# EAGLE design untitled (EAGLE 9.5.2)
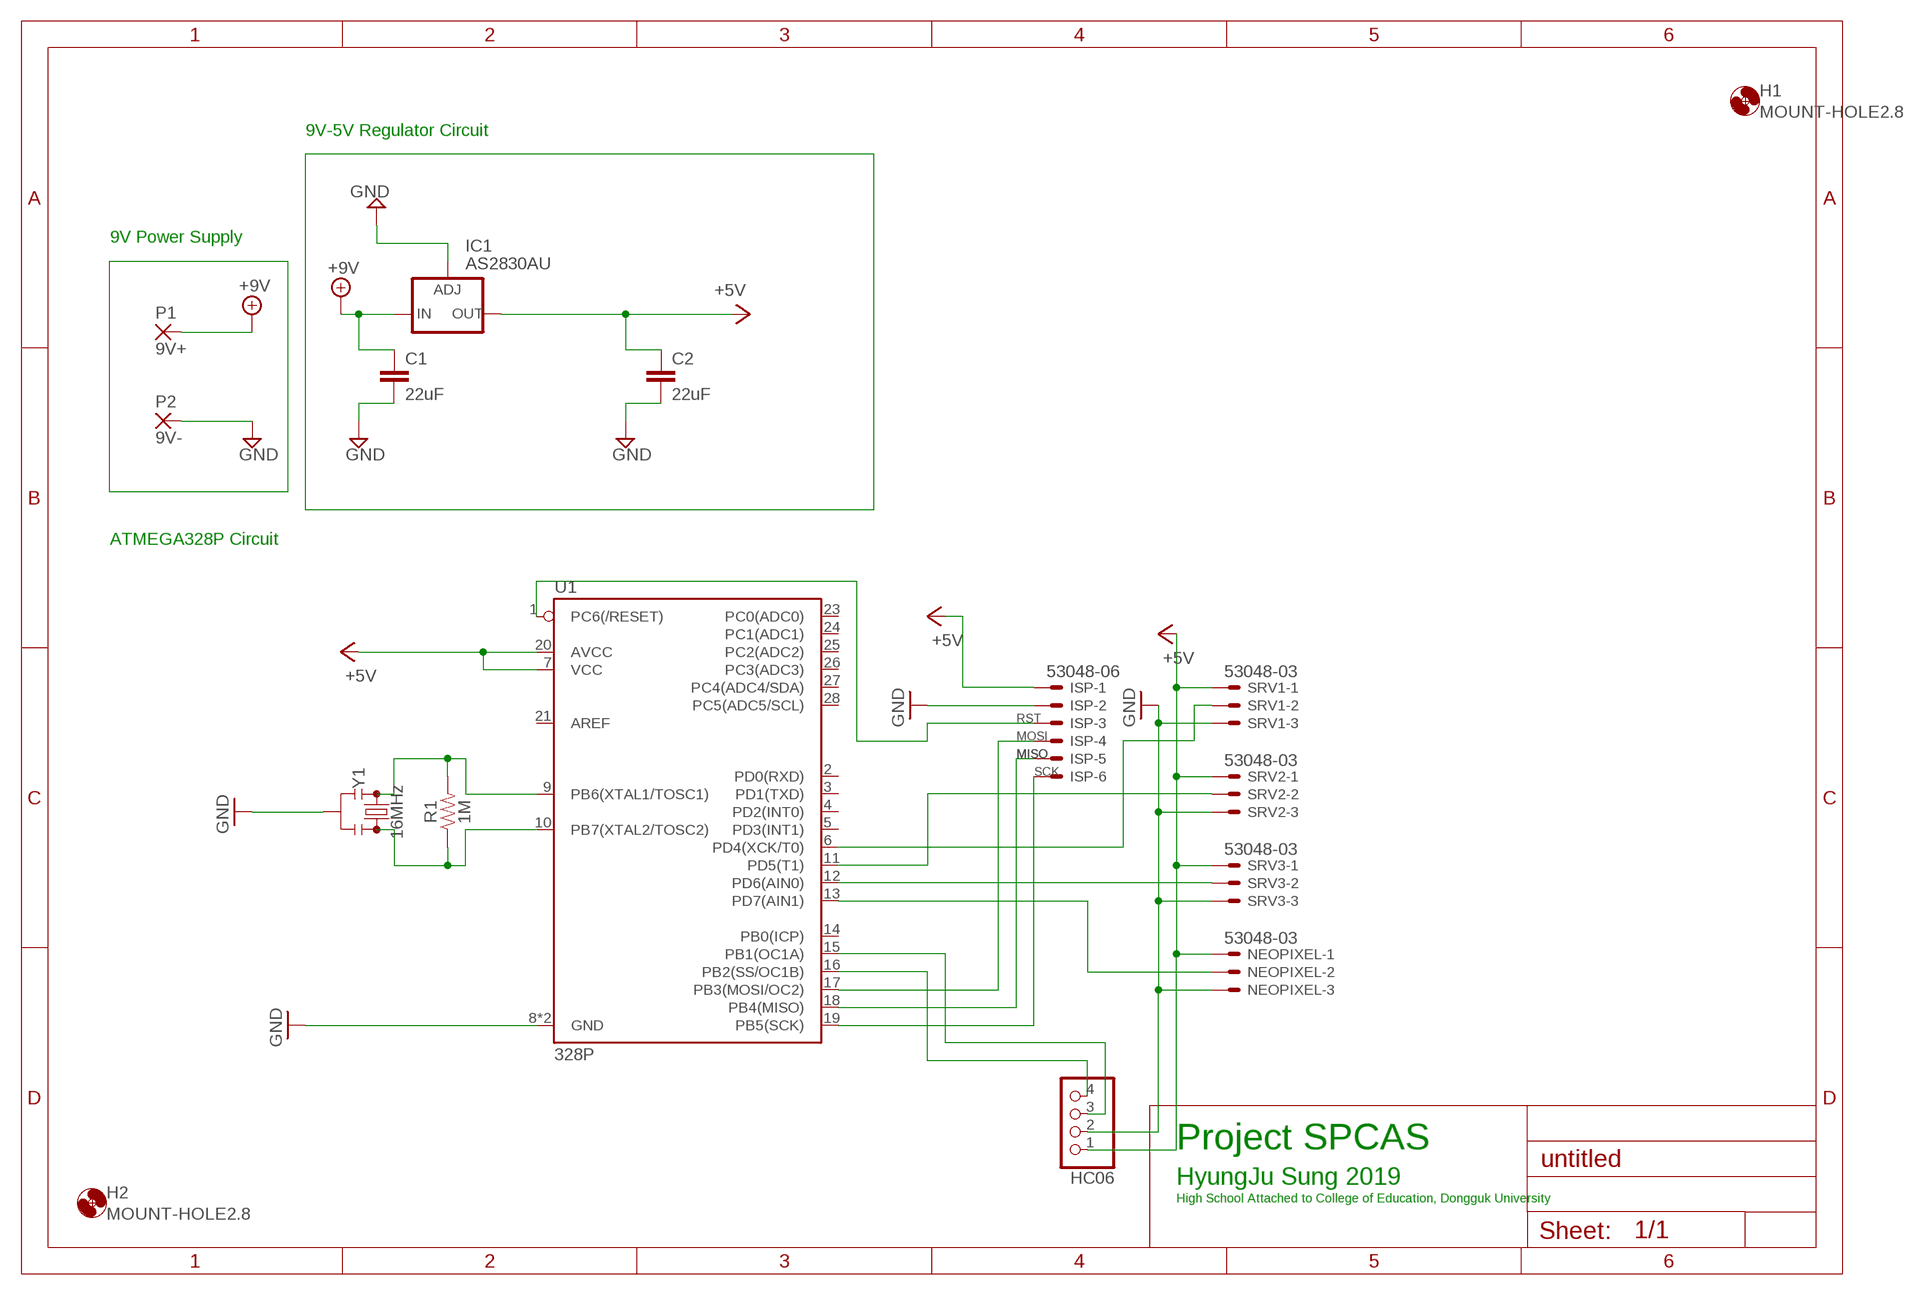
[diagram p0: schematic, sheet 1]

## Parts
C1  22uF  C2.5/2  [C2.5-2]
C2  22uF  C2.5/2  [C2.5-2]
H1  MOUNT-HOLE2.8  [2,8]
H2  MOUNT-HOLE2.8  [2,8]
HC06  PINHD-1X4/90  [1X04/90]
IC1  AS2830AU  LM337TL  [337TL]
ISP  53048-06  [53048-06]
NEOPIXEL  53048-03  [53048-03]
P1  9V+  SMD5  [SMD2,54-5,08]
P2  9V-  SMD5  [SMD2,54-5,08]
R1  1M  1MOHM-HORIZ-1/4W-5%  [AXIAL-0.3]
SRV1  53048-03  [53048-03]
SRV2  53048-03  [53048-03]
SRV3  53048-03  [53048-03]
U1  328P  ATMEGA328P_PDIP  [DIP28]
Y1  16MHz  RESONATOR-16MHZSMD_3.2X1.3  [RESONATOR-SMD-3.2X1.3]

## Nets
+5V: C2.1 HC06.1 IC1.3(OUT) ISP.1 NEOPIXEL.1 SRV1.1 SRV2.1 SRV3.1 U1.7(VCC) U1.20(AVCC)
+9V: C1.1 IC1.2(IN) P1.1(P)
GND: C1.2 C2.2 HC06.2 IC1.1(ADJ) ISP.2 NEOPIXEL.3 P2.1(P) SRV1.3 SRV2.3 SRV3.3 U1.8(GND) U1.22(GND) Y1.2
MISO: ISP.5 U1.18(PB4(MISO))
MOSI: ISP.4 U1.17(PB3(MOSI/OC2))
N$3: R1.P$2 U1.9(PB6(XTAL1/TOSC1)) Y1.1
N$4: R1.P$1 U1.10(PB7(XTAL2/TOSC2)) Y1.3
N$5: NEOPIXEL.2 U1.13(PD7(AIN1))
N$6: SRV3.2 U1.12(PD6(AIN0))
N$7: SRV2.2 U1.11(PD5(T1))
N$8: SRV1.2 U1.6(PD4(XCK/T0))
N$9: HC06.4 U1.16(PB2(SS/OC1B))
N$10: HC06.3 U1.15(PB1(OC1A))
RST: ISP.3 U1.1(PC6(/RESET))
SCK: ISP.6 U1.19(PB5(SCK))
Unconnected: U1.2(PD0(RXD)) U1.3(PD1(TXD)) U1.4(PD2(INT0)) U1.5(PD3(INT1)) U1.14(PB0(ICP)) U1.21(AREF) U1.23(PC0(ADC0)) U1.24(PC1(ADC1)) U1.25(PC2(ADC2)) U1.26(PC3(ADC3)) U1.27(PC4(ADC4/SDA)) U1.28(PC5(ADC5/SCL))

## Notes on the sheet
- 9V-5V Regulator Circuit
- 9V Power Supply
- ATMEGA328P Circuit
- Project SPCAS
- HyungJu Sung 2019
- High School Attached to College of Education, Dongguk University

## Library data of the parts
C1 C2 = capacitor-wima:C: CAPACITOR naming: grid - package width
H1 H2 = holes:MOUNT-HOLE: MOUNTING HOLE with drill center marker
HC06 = pinhead:PINHD-1X4: PIN HEADER
IC1 = v-reg:LM337TL: VOLTAGE REGULATOR
ISP = con-molex:53?-06: CONNECTOR wire to board 1.25 mm (.049 inch) pitch header; MF: WALDOM/MOLEX; MPN: 53048-0610; OC_FARNELL: 1012260; OC_NEWARK: 38C9911
NEOPIXEL SRV1-SRV3 = con-molex:53?-03: CONNECTOR wire to board 1.25 mm (.049 inch) pitch header; MF: WALDOM/MOLEX; MPN: 53048-0310; OC_FARNELL: 9732918; OC_NEWARK: 38C9908
P1 P2 = wirepad:SMD5: SMD PAD
R1 = SparkFun-Resistors:1MOHM: 1MΩ resistor A resistor is a passive two-terminal electrical component that implements electrical resistance as a circuit element. Resistors act to reduce current flow, and, at the same time, act to lower voltage levels within circuits. - Wikipedia; PROD_ID: RES-09329
U1 = SparkFun-IC-Microcontroller:ATMEGA328P_PDIP: Atmel 328P Through hole ATMEGA328P uC used in the Arduino 32kb flash, 1k EEPROM, 2k SRAM Datasheet <http://www.sparkfun.com/datasheets/Components/SMD/ATMega328.pdf> SparkFun Products Storefront component: AVR 28 Pin 20MHz 32K 6A/D - ATMega328P <https://www.sparkfun.com/products/9061> (COM-09061) SparkFun Simon Says - Through-Hole Soldering Kit <https://www.sparkfun.com/products/10547> (KIT-10547) SparkFun Learn to Solder - Simon Says <https://www.sparkfun.com/products/13708> (KIT-13708) SparkFun BigTime Watch Kit <https://www.sparkfun.com/products/11734> (KIT-11734) SparkFun ClockIt <https://www.sparkfun.com/products/10930> (KIT-10930) SparkFun Serial Enabled LCD Kit <https://www.sparkfun.com/products/10097> (LCD-10097) SparkFun Simon Tilts - Through Hole Soldering Kit <https://www.sparkfun.com/products/12634> (KIT-12634) SparkFun Frequency Counter Kit <https://www.sparkfun.com/products/10140> (KIT-10140) FabFM Radio Kit <https://www.sparkfun.com/products/11043> (KIT-11043) SparkFun Binary Blaster Kit <https://www.sparkfun.com/products/12037> (KIT-12037) SparkFun Metro-Gnome <https://www.sparkfun.com/products/9236> (KIT-09236) ATmega328 with Arduino Optiboot (Uno) <https://www.sparkfun.com/products/10524> (DEV-10524); PROD_ID: IC-09136
Y1 = SparkFun-Clocks:RESONATOR-16MHZ: 16MHz Resonator Digikey Example <http://www.digikey.com/product-detail/en/murata-electronics-north-america/CSTCE16M0V53-R0/490-1198-1-ND/584635> Frequency: 16MHz Frequency Stability: ±0.3% Frequency Tolerance: ±0.5% Capacitance: 15pF SparkFun Products SparkFun OpenLog <https://www.sparkfun.com/products/13712> SparkFun MicroView - OLED Arduino Module <https://www.sparkfun.com/products/12923>; PROD_ID: XTAL-08900

## Board
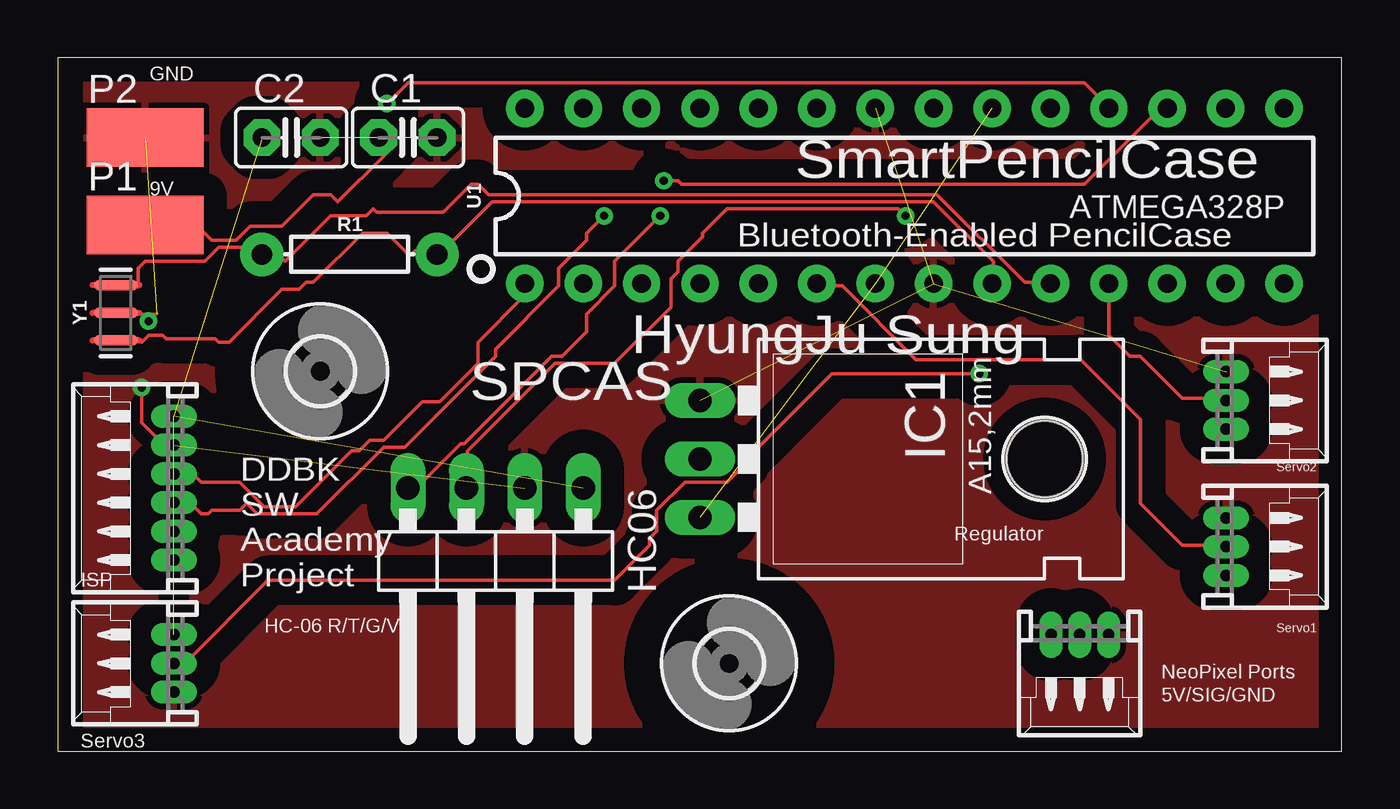
[diagram p1: board, top side]
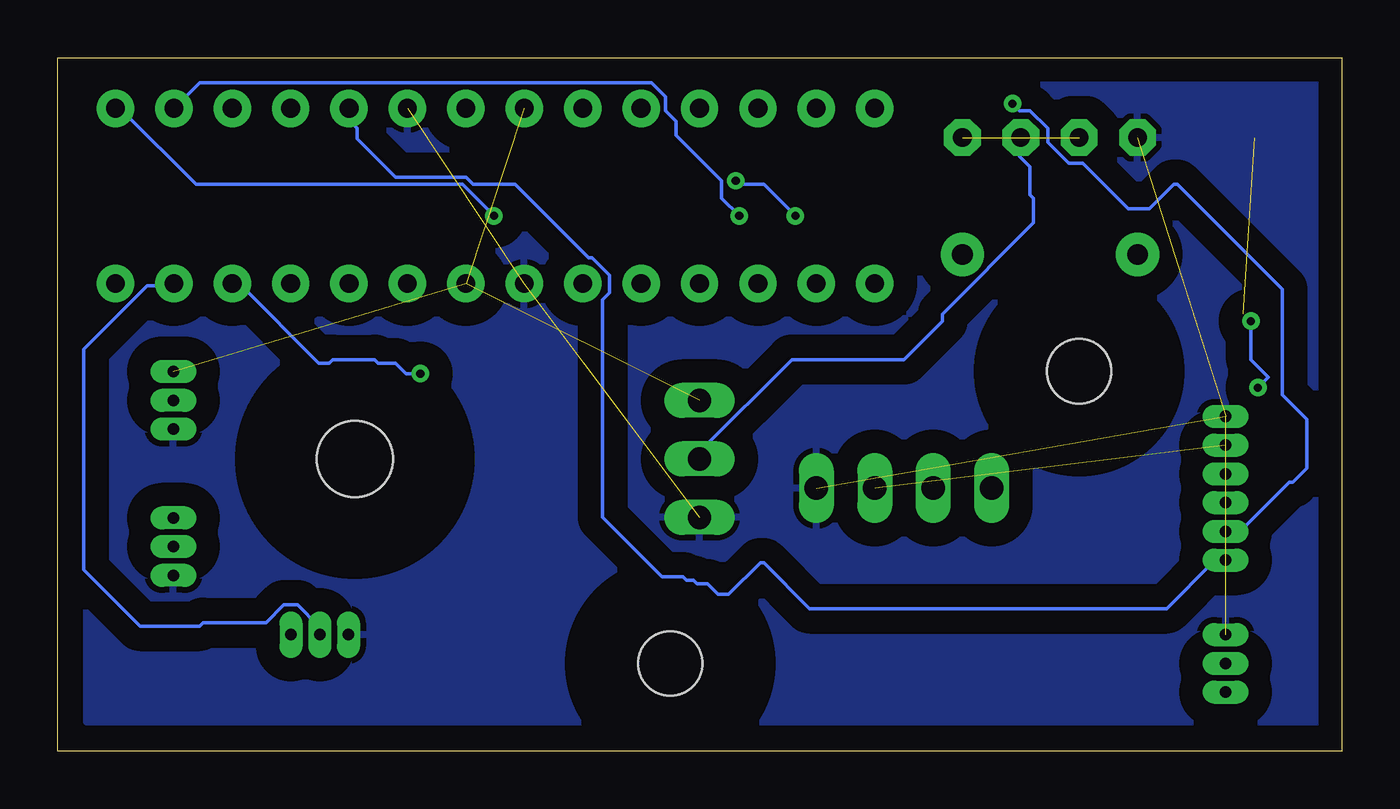
[diagram p2: board, bottom side, seen from below]

Size 55.86 x 30.15 mm. Coordinates in mm from the lower left corner, seen from the top.
Outline: 0,0 55.86,0 55.86,30.15 0,30.15 0,0
Copper layers (1*16): Top 0.035mm / dielectric 1.5mm / Bottom 0.035mm
Design rules "default": minimum track width 6mil, minimum drill 0.35mm, track to track 6mil, track to pad 6mil, pad to pad 6mil, via to via 6mil, smd to smd 6mil, copper to edge 40mil, drill to drill 6mil, minimum pad ring 10mil, minimum via ring 8mil, stop-mask expansion 4mil, vias tented up to drill 0mil, thermal gap 10mil

### Footprints (pad centres in the part's own frame; a part is rotated, then mirrored left to right if it is on the bottom)
C2.5-2 = drill 0.813 pad 1.6 octagon: 1 -1.27,0; 2 1.27,0
2,8 = hole 2.8: 0,0
1X04/90 = drill 1.016 long: 1 -3.81,-3.81; 2 -1.27,-3.81; 3 1.27,-3.81; 4 3.81,-3.81
337TL = drill 1.016 long: 1 -2.54,-3.81; 2 0,-3.81; 3 2.54,-3.81 | hole 3.302: 0,11.176
53048-06 = drill 0.5 pad 0.698 long: 1 3.125,-1.25; 2 1.875,-1.25; 3 0.625,-1.25; 4 -0.625,-1.25; 5 -1.875,-1.25; 6 -3.125,-1.25
53048-03 = drill 0.5 pad 0.698 long: 1 1.25,-1.25; 2 0,-1.25; 3 -1.25,-1.25
SMD2,54-5,08 = smd 2.54 x 5.08: 1 0,0
AXIAL-0.3 = drill 0.9 pad 1.88: P$1 -3.81,0; P$2 3.81,0
DIP28 = drill 0.813 pad 1.626: 1 -16.51,-3.81; 2 -13.97,-3.81; 3 -11.43,-3.81; 4 -8.89,-3.81; 5 -6.35,-3.81; 6 -3.81,-3.81; 7 -1.27,-3.81; 8 1.27,-3.81; 9 3.81,-3.81; 10 6.35,-3.81; 11 8.89,-3.81; 12 11.43,-3.81; 13 13.97,-3.81; 14 16.51,-3.81; 15 16.51,3.81; 16 13.97,3.81; 17 11.43,3.81; 18 8.89,3.81; 19 6.35,3.81; 20 3.81,3.81; 21 1.27,3.81; 22 -1.27,3.81; 23 -3.81,3.81; 24 -6.35,3.81; 25 -8.89,3.81; 26 -11.43,3.81; 27 -13.97,3.81; 28 -16.51,3.81
RESONATOR-SMD-3.2X1.3 = smd 0.45 x 1.905: 1 -1.2,0; 2 0,0; 3 1.2,0

### Placement (x,y rotation side)
C1  15.24,26.67 0 top
C2  10.16,26.67 0 top
H1  29.21,3.81 0 top
H2  11.43,16.51 0 top
HC06  19.05,7.62 180 top
IC1  31.75,12.7 270 top
ISP  3.81,11.43 90 top
NEOPIXEL  44.45,3.81 180 top
P1  3.81,22.86 270 top
P2  3.81,26.67 270 top
R1  12.7,21.59 0 top
SRV1  52.07,8.89 270 top
SRV2  52.07,15.24 270 top
SRV3  3.81,3.81 90 top
U1  36.83,24.13 0 top
Y1  2.54,19.05 90 top

### Tracks (layer width: path | path; a pad name or v marks a point on that pad's centre or on a via)
+5V  (5 unrouted)
  pour Bottom (isolate 1.016): 1.27,29.21 54.61,29.21 54.61,1.27 0,1.27 0,27.94
+9V
  Top 0.152: C1.1 14.17,26.47 14.17,25.86 12.19,23.88 11.89,24.18 11.12,24.18 9.75,22.81 8.38,22.81 7.77,22.2 6.71,22.2 6.1,22.81 3.81,22.81 P1.1
  Bottom 0.152: IC1.2 27.89,12.75 27.89,13.06 23.93,17.02 19.05,17.02 17.37,18.69 17.37,19 13.41,22.96 13.41,24.03 13.56,24.18 13.56,25.4 14.02,25.86 14.02,26.62 C1.1
GND  (via drill 0.35)  (6 unrouted)
  Top 0.152: 3.96,19 4.27,19 4.31,19.02 | 3.96,19 3.66,19 Y1.2 | v3.96,18.69 3.96,19 | v3.66,15.8 3.66,14.28 4.57,13.36 5.03,13.36 ISP.2
  Bottom 0.152: v3.96,18.69 3.96,17.02 3.2,16.26 v3.66,15.8
  pour Top (isolate 1.016): 1.27,29.21 54.61,29.21 55.88,27.94 55.88,1.27 54.61,0 1.27,0
MISO  (via drill 0.35)
  Top 0.152: v14.33,28.14 15.24,29.06 44.65,29.06 45.72,27.99 U1.18
  Bottom 0.152: v14.33,28.14 14.02,27.84 13.56,27.84 12.8,27.08 12.8,26.47 11.89,25.55 11.28,25.55 9.3,23.57 8.38,23.57 7.32,24.64 7.16,24.64 2.59,20.07 2.59,15.49 1.52,14.43 1.52,12.29 2.13,11.68 2.29,11.68 4.27,9.7 5.03,9.7 ISP.5
MOSI  (via drill 0.35)
  Top 0.152: v23.77,23.27 23.01,22.5 23.01,22.2 21.79,20.98 21.79,20.22 19.05,17.48 19.05,17.17 15.09,13.21 14.17,13.21 11.28,10.31 8.69,10.31 8.23,10.77 7.92,10.47 6.71,10.47 6.55,10.31 6.25,10.31 5.79,10.77 5.18,10.77 ISP.4 | v26.36,24.79 26.98,24.79 27.13,24.64 44.65,24.64 47.85,27.84 48.16,27.84 U1.17
  Bottom 0.152: v23.77,23.27 25.15,24.64 26.21,24.64 v26.36,24.79
N$3
  Top 0.152: Y1.1 3.66,17.78 3.96,18.09 4.57,18.09 4.72,17.93 6.86,17.93 7.01,17.78 7.47,17.78 9.75,20.07 10.52,20.07 10.82,20.37 11.12,20.37 13.26,22.5 14.33,22.5 15.24,21.59 15.39,21.59 15.54,21.74 16.31,21.74 16.46,21.59 R1.P$2 16.61,21.59 18.9,23.88 38.1,23.88 40.69,21.29 40.69,20.37 U1.9
N$4
  Top 0.152: Y1.3 3.5,20.37 3.5,20.98 3.81,21.29 6.4,21.29 7.01,21.9 8.53,21.9 8.84,21.59 R1.P$1 9.6,21.59 9.91,21.29 11.89,23.27 13.41,23.27 13.72,23.57 13.87,23.42 16.76,23.42 17.98,24.64 18.29,24.64 18.75,24.18 38.25,24.18 42.06,20.37 43.13,20.37 U1.10
N$5
  Bottom 0.152: NEOPIXEL.2 44.5,5.13 44.5,5.44 45.41,6.35 46.02,6.35 46.79,5.59 49.53,5.59 49.68,5.44 52.27,5.44 54.71,7.87 54.71,17.48 51.97,20.22 50.9,20.22 U1.13
N$6  (via drill 0.35)
  Top 0.152: v40.08,16.41 33.68,16.41 29.87,12.6 29.87,12.45 29.11,11.68 27.28,11.68 26.06,10.47 26.06,9.55 25.76,9.25 25.76,8.94 24.23,7.42 9.14,7.42 5.64,3.91 5.18,3.91 SRV3.2
  Bottom 0.152: v40.08,16.41 40.69,16.41 41.15,16.87 41.91,16.87 42.06,17.02 43.89,17.02 44.04,16.87 44.5,16.87 47.85,20.22 48.16,20.22 U1.12
N$7
  Top 0.152: U1.11 45.72,18.09 46.63,17.17 47.09,17.17 48.92,15.34 50.75,15.34 SRV2.2
N$8
  Top 0.152: SRV1.2 50.75,8.94 48.92,8.94 47.09,10.77 47.09,14.43 44.5,17.02 37.34,17.02 34.14,20.22 33.07,20.22 U1.6
N$9  (via drill 0.35)
  Top 0.152: v26.21,23.27 24.23,21.29 24.23,20.22 23.01,19 23.01,18.24 21.95,17.17 21.49,17.17 17.68,13.36 17.53,13.36 15.7,11.53 15.24,11.53 HC06.4
  Bottom 0.152: v26.21,23.27 26.98,24.03 26.98,24.79 28.96,26.77 28.96,27.38 29.41,27.84 29.41,28.45 30.02,29.06 49.68,29.06 U1.16
N$10  (via drill 0.35)
  Top 0.152: v36.88,23.27 36.58,23.57 29.11,23.57 28.04,22.5 28.04,22.35 26.98,21.29 26.98,20.83 26.67,20.52 26.67,19.3 24.23,16.87 21.64,16.87 17.83,13.06 17.83,11.53 HC06.3
  Bottom 0.152: v36.88,23.27 38.25,24.64 49.84,24.64 53.03,27.84 53.34,27.84 U1.15
RST
  Top 0.152: ISP.3 5.18,11.99 5.94,11.99 6.25,11.68 7.92,11.68 8.99,10.62 10.36,10.62 12.8,13.06 13.11,13.06 13.56,13.51 14.17,13.51 15.85,15.19 16.61,15.19 18.29,16.87 18.29,17.78 20.27,19.76 20.27,20.22 U1.1
SCK
  Bottom 0.152: ISP.6 5.18,8.18 5.64,8.18 7.62,6.2 23.16,6.2 25.15,8.18 25.3,8.18 26.67,6.81 27.13,6.81 27.58,7.26 28.04,7.26 28.19,7.42 28.5,7.42 28.65,7.57 29.57,7.57 32.16,10.16 32.16,19.61 31.85,19.91 31.85,20.68 32.61,21.44 32.77,21.44 35.97,24.64 37.8,24.64 38.1,24.94 41.15,24.94 42.82,26.62 42.82,27.08 43.13,27.38 43.13,27.84 U1.19

### Text on the board
tNames: GND | SmartPencilCase | 9V | ATMEGA328P | Bluetooth-Enabled PencilCase | HyungJu Sung | SPCAS | Servo2 | Regulator | ISP | DDBK / SW / Academy / Project | HC-06 R/T/G/V | Servo1 | NeoPixel Ports | 5V/SIG/GND | Servo3